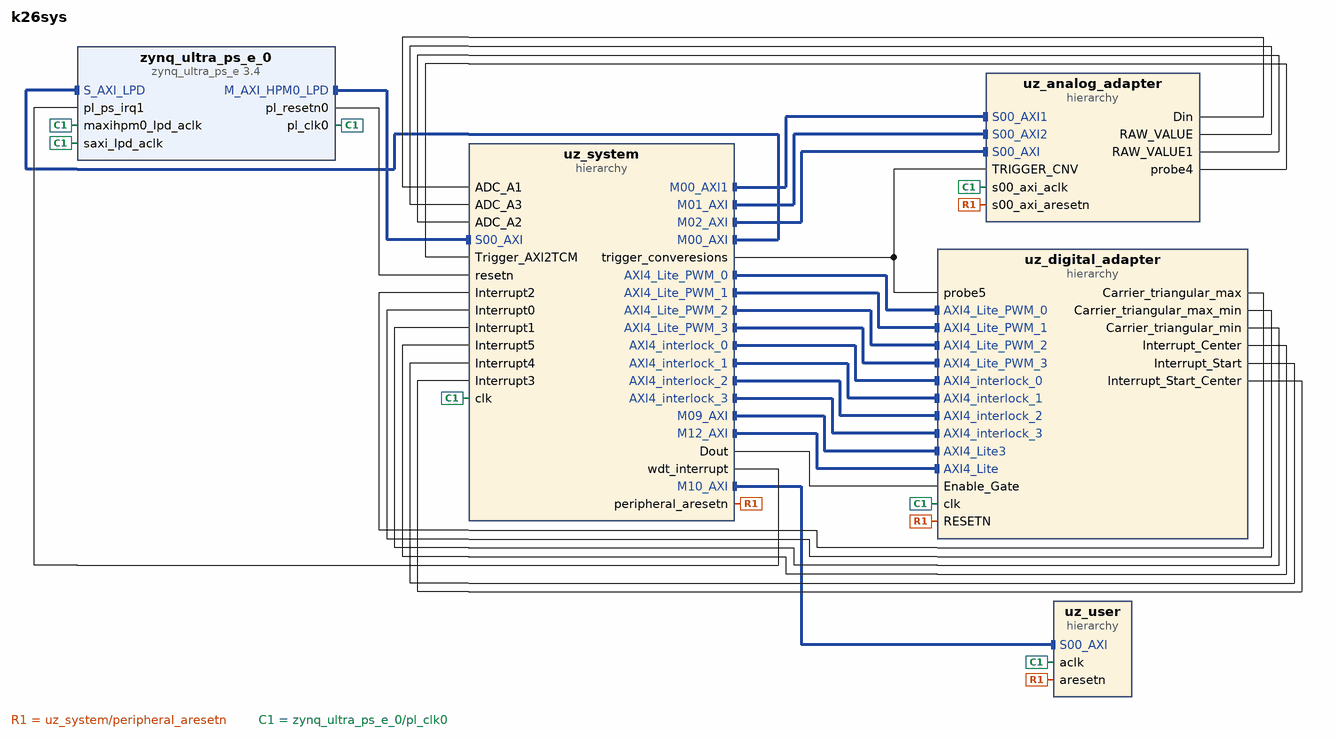
[diagram p0: block diagram of the top level]
# Vivado block design k26sys, xck26-sfvc784-2LV-c, Vivado 2022.2
create_bd_design k26sys

create_bd_cell -type ip -vlnv xilinx.com:ip:zynq_ultra_ps_e:3.4 zynq_ultra_ps_e_0
set_property -dict [list \
  CONFIG.PSU_BANK_0_IO_STANDARD LVCMOS18 \
  CONFIG.PSU_BANK_1_IO_STANDARD LVCMOS18 \
  CONFIG.PSU_BANK_2_IO_STANDARD LVCMOS18 \
  CONFIG.PSU_BANK_3_IO_STANDARD LVCMOS18 \
  CONFIG.PSU_USB3__DUAL_CLOCK_ENABLE 0 \
  CONFIG.PSU__CRF_APB__ACPU_CTRL__FREQMHZ 1333.333 \
  CONFIG.PSU__CRF_APB__ACPU_CTRL__SRCSEL APLL \
  CONFIG.PSU__CRF_APB__APLL_CTRL__SRCSEL PSS_REF_CLK \
  CONFIG.PSU__CRF_APB__APLL_FRAC_CFG__ENABLED 1 \
  CONFIG.PSU__CRF_APB__DBG_FPD_CTRL__FREQMHZ 250 \
  CONFIG.PSU__CRF_APB__DBG_FPD_CTRL__SRCSEL IOPLL \
  CONFIG.PSU__CRF_APB__DBG_TRACE_CTRL__FREQMHZ 250 \
  CONFIG.PSU__CRF_APB__DBG_TRACE_CTRL__SRCSEL IOPLL \
  CONFIG.PSU__CRF_APB__DBG_TSTMP_CTRL__FREQMHZ 250 \
  CONFIG.PSU__CRF_APB__DBG_TSTMP_CTRL__SRCSEL IOPLL \
  CONFIG.PSU__CRF_APB__DDR_CTRL__FREQMHZ 1200 \
  CONFIG.PSU__CRF_APB__DDR_CTRL__SRCSEL DPLL \
  CONFIG.PSU__CRF_APB__DPDMA_REF_CTRL__FREQMHZ 600 \
  CONFIG.PSU__CRF_APB__DPDMA_REF_CTRL__SRCSEL APLL \
  CONFIG.PSU__CRF_APB__DPLL_CTRL__SRCSEL PSS_REF_CLK \
  CONFIG.PSU__CRF_APB__DP_AUDIO_REF_CTRL__SRCSEL RPLL \
  CONFIG.PSU__CRF_APB__DP_STC_REF_CTRL__SRCSEL RPLL \
  CONFIG.PSU__CRF_APB__DP_VIDEO_REF_CTRL__SRCSEL VPLL \
  CONFIG.PSU__CRF_APB__GDMA_REF_CTRL__FREQMHZ 600 \
  CONFIG.PSU__CRF_APB__GDMA_REF_CTRL__SRCSEL DPLL \
  CONFIG.PSU__CRF_APB__GPU_REF_CTRL__FREQMHZ 600 \
  CONFIG.PSU__CRF_APB__GPU_REF_CTRL__SRCSEL IOPLL \
  CONFIG.PSU__CRF_APB__TOPSW_LSBUS_CTRL__FREQMHZ 100 \
  CONFIG.PSU__CRF_APB__TOPSW_LSBUS_CTRL__SRCSEL IOPLL \
  CONFIG.PSU__CRF_APB__TOPSW_MAIN_CTRL__FREQMHZ 533.33 \
  CONFIG.PSU__CRF_APB__TOPSW_MAIN_CTRL__SRCSEL DPLL \
  CONFIG.PSU__CRF_APB__VPLL_CTRL__SRCSEL PSS_REF_CLK \
  CONFIG.PSU__CRL_APB__ADMA_REF_CTRL__FREQMHZ 500 \
  CONFIG.PSU__CRL_APB__ADMA_REF_CTRL__SRCSEL IOPLL \
  CONFIG.PSU__CRL_APB__CPU_R5_CTRL__FREQMHZ 533.333 \
  CONFIG.PSU__CRL_APB__CPU_R5_CTRL__SRCSEL RPLL \
  CONFIG.PSU__CRL_APB__DBG_LPD_CTRL__FREQMHZ 250 \
  CONFIG.PSU__CRL_APB__DBG_LPD_CTRL__SRCSEL IOPLL \
  CONFIG.PSU__CRL_APB__IOPLL_CTRL__SRCSEL PSS_REF_CLK \
  CONFIG.PSU__CRL_APB__IOU_SWITCH_CTRL__FREQMHZ 250 \
  CONFIG.PSU__CRL_APB__IOU_SWITCH_CTRL__SRCSEL IOPLL \
  CONFIG.PSU__CRL_APB__LPD_LSBUS_CTRL__FREQMHZ 100 \
  CONFIG.PSU__CRL_APB__LPD_LSBUS_CTRL__SRCSEL IOPLL \
  CONFIG.PSU__CRL_APB__LPD_SWITCH_CTRL__FREQMHZ 500 \
  CONFIG.PSU__CRL_APB__LPD_SWITCH_CTRL__SRCSEL IOPLL \
  CONFIG.PSU__CRL_APB__PCAP_CTRL__FREQMHZ 200 \
  CONFIG.PSU__CRL_APB__PCAP_CTRL__SRCSEL IOPLL \
  CONFIG.PSU__CRL_APB__PL0_REF_CTRL__FREQMHZ 100 \
  CONFIG.PSU__CRL_APB__PL0_REF_CTRL__SRCSEL IOPLL \
  CONFIG.PSU__CRL_APB__QSPI_REF_CTRL__FREQMHZ 125 \
  CONFIG.PSU__CRL_APB__QSPI_REF_CTRL__SRCSEL IOPLL \
  CONFIG.PSU__CRL_APB__RPLL_CTRL__SRCSEL PSS_REF_CLK \
  CONFIG.PSU__CRL_APB__SPI1_REF_CTRL__SRCSEL IOPLL \
  CONFIG.PSU__CRL_APB__TIMESTAMP_REF_CTRL__FREQMHZ 100 \
  CONFIG.PSU__CRL_APB__TIMESTAMP_REF_CTRL__SRCSEL IOPLL \
  CONFIG.PSU__CRL_APB__USB3__ENABLE 0 \
  CONFIG.PSU__CSUPMU__PERIPHERAL__VALID 1 \
  CONFIG.PSU__DDRC__BUS_WIDTH {64 Bit} \
  CONFIG.PSU__DDRC__COMPONENTS Components \
  CONFIG.PSU__DDRC__DEVICE_CAPACITY {8192 MBits} \
  CONFIG.PSU__DDRC__DRAM_WIDTH {16 Bits} \
  CONFIG.PSU__DDRC__ECC Disabled \
  CONFIG.PSU__DDRC__MEMORY_TYPE {DDR 4} \
  CONFIG.PSU__DDRC__SPEED_BIN DDR4_2400R \
  CONFIG.PSU__DDR_HIGH_ADDRESS_GUI_ENABLE 1 \
  CONFIG.PSU__DDR__INTERFACE__FREQMHZ 600.000 \
  CONFIG.PSU__DISPLAYPORT__LANE0__ENABLE 1 \
  CONFIG.PSU__DISPLAYPORT__LANE0__IO {GT Lane1} \
  CONFIG.PSU__DISPLAYPORT__LANE1__ENABLE 0 \
  CONFIG.PSU__DISPLAYPORT__PERIPHERAL__ENABLE 1 \
  CONFIG.PSU__DPAUX__PERIPHERAL__ENABLE 1 \
  CONFIG.PSU__DPAUX__PERIPHERAL__IO {MIO 27 .. 30} \
  CONFIG.PSU__DP__LANE_SEL None \
  CONFIG.PSU__ENET1__GRP_MDIO__ENABLE 1 \
  CONFIG.PSU__ENET1__GRP_MDIO__IO {MIO 50 .. 51} \
  CONFIG.PSU__ENET1__PERIPHERAL__ENABLE 1 \
  CONFIG.PSU__ENET1__PERIPHERAL__IO {MIO 38 .. 49} \
  CONFIG.PSU__ENET3__PERIPHERAL__ENABLE 0 \
  CONFIG.PSU__FPGA_PL0_ENABLE 1 \
  CONFIG.PSU__GEM__TSU__ENABLE 0 \
  CONFIG.PSU__GPIO0_MIO__IO {MIO 0 .. 25} \
  CONFIG.PSU__GPIO0_MIO__PERIPHERAL__ENABLE 1 \
  CONFIG.PSU__GPIO1_MIO__IO {MIO 26 .. 51} \
  CONFIG.PSU__GPIO1_MIO__PERIPHERAL__ENABLE 1 \
  CONFIG.PSU__GT__LINK_SPEED HBR \
  CONFIG.PSU__GT__PRE_EMPH_LVL_4 0 \
  CONFIG.PSU__GT__VLT_SWNG_LVL_4 0 \
  CONFIG.PSU__I2C1__PERIPHERAL__ENABLE 1 \
  CONFIG.PSU__I2C1__PERIPHERAL__IO {MIO 24 .. 25} \
  CONFIG.PSU__IOU_SLCR__IOU_TTC_APB_CLK__TTC0_SEL APB \
  CONFIG.PSU__IOU_SLCR__IOU_TTC_APB_CLK__TTC1_SEL APB \
  CONFIG.PSU__IOU_SLCR__IOU_TTC_APB_CLK__TTC2_SEL APB \
  CONFIG.PSU__IOU_SLCR__IOU_TTC_APB_CLK__TTC3_SEL APB \
  CONFIG.PSU__MAXIGP2__DATA_WIDTH 128 \
  CONFIG.PSU__OVERRIDE__BASIC_CLOCK 0 \
  CONFIG.PSU__PMU_COHERENCY 0 \
  CONFIG.PSU__PMU__AIBACK__ENABLE 0 \
  CONFIG.PSU__PMU__EMIO_GPI__ENABLE 0 \
  CONFIG.PSU__PMU__EMIO_GPO__ENABLE 0 \
  CONFIG.PSU__PMU__GPI0__ENABLE 1 \
  CONFIG.PSU__PMU__GPI0__IO {MIO 26} \
  CONFIG.PSU__PMU__GPI1__ENABLE 0 \
  CONFIG.PSU__PMU__GPI2__ENABLE 0 \
  CONFIG.PSU__PMU__GPI3__ENABLE 0 \
  CONFIG.PSU__PMU__GPI4__ENABLE 0 \
  CONFIG.PSU__PMU__GPI5__ENABLE 1 \
  CONFIG.PSU__PMU__GPI5__IO {MIO 31} \
  CONFIG.PSU__PMU__GPO0__ENABLE 0 \
  CONFIG.PSU__PMU__GPO1__ENABLE 0 \
  CONFIG.PSU__PMU__GPO2__ENABLE 0 \
  CONFIG.PSU__PMU__GPO3__ENABLE 1 \
  CONFIG.PSU__PMU__GPO3__IO {MIO 35} \
  CONFIG.PSU__PMU__GPO3__POLARITY low \
  CONFIG.PSU__PMU__GPO4__ENABLE 0 \
  CONFIG.PSU__PMU__GPO5__ENABLE 0 \
  CONFIG.PSU__PMU__PERIPHERAL__ENABLE 1 \
  CONFIG.PSU__PMU__PLERROR__ENABLE 0 \
  CONFIG.PSU__PRESET_APPLIED 1 \
  CONFIG.PSU__PSS_REF_CLK__FREQMHZ 33.333 \
  CONFIG.PSU__QSPI_COHERENCY 0 \
  CONFIG.PSU__QSPI_ROUTE_THROUGH_FPD 0 \
  CONFIG.PSU__QSPI__GRP_FBCLK__ENABLE 0 \
  CONFIG.PSU__QSPI__PERIPHERAL__DATA_MODE x4 \
  CONFIG.PSU__QSPI__PERIPHERAL__ENABLE 1 \
  CONFIG.PSU__QSPI__PERIPHERAL__IO {MIO 0 .. 5} \
  CONFIG.PSU__QSPI__PERIPHERAL__MODE Single \
  CONFIG.PSU__SAXIGP6__DATA_WIDTH 32 \
  CONFIG.PSU__SPI1__GRP_SS0__IO {MIO 9} \
  CONFIG.PSU__SPI1__PERIPHERAL__ENABLE 1 \
  CONFIG.PSU__SPI1__PERIPHERAL__IO {MIO 6 .. 11} \
  CONFIG.PSU__SWDT0__CLOCK__ENABLE 0 \
  CONFIG.PSU__SWDT0__PERIPHERAL__ENABLE 1 \
  CONFIG.PSU__SWDT0__RESET__ENABLE 0 \
  CONFIG.PSU__SWDT1__CLOCK__ENABLE 0 \
  CONFIG.PSU__SWDT1__PERIPHERAL__ENABLE 1 \
  CONFIG.PSU__SWDT1__RESET__ENABLE 0 \
  CONFIG.PSU__TSU__BUFG_PORT_PAIR 0 \
  CONFIG.PSU__TTC0__CLOCK__ENABLE 0 \
  CONFIG.PSU__TTC0__PERIPHERAL__ENABLE 1 \
  CONFIG.PSU__TTC0__WAVEOUT__ENABLE 1 \
  CONFIG.PSU__TTC0__WAVEOUT__IO EMIO \
  CONFIG.PSU__TTC1__CLOCK__ENABLE 0 \
  CONFIG.PSU__TTC1__PERIPHERAL__ENABLE 1 \
  CONFIG.PSU__TTC1__WAVEOUT__ENABLE 0 \
  CONFIG.PSU__TTC2__CLOCK__ENABLE 0 \
  CONFIG.PSU__TTC2__PERIPHERAL__ENABLE 1 \
  CONFIG.PSU__TTC2__WAVEOUT__ENABLE 0 \
  CONFIG.PSU__TTC3__CLOCK__ENABLE 0 \
  CONFIG.PSU__TTC3__PERIPHERAL__ENABLE 1 \
  CONFIG.PSU__TTC3__WAVEOUT__ENABLE 0 \
  CONFIG.PSU__UART0__PERIPHERAL__ENABLE 0 \
  CONFIG.PSU__UART1__BAUD_RATE 115200 \
  CONFIG.PSU__UART1__MODEM__ENABLE 0 \
  CONFIG.PSU__UART1__PERIPHERAL__ENABLE 1 \
  CONFIG.PSU__UART1__PERIPHERAL__IO {MIO 36 .. 37} \
  CONFIG.PSU__USB0__PERIPHERAL__ENABLE 0 \
  CONFIG.PSU__USB0__RESET__ENABLE 1 \
  CONFIG.PSU__USB0__RESET__IO {MIO 76} \
  CONFIG.PSU__USB1__RESET__ENABLE 1 \
  CONFIG.PSU__USB1__RESET__IO {MIO 77} \
  CONFIG.PSU__USE__IRQ0 1 \
  CONFIG.PSU__USE__IRQ1 1 \
  CONFIG.PSU__USE__M_AXI_GP0 0 \
  CONFIG.PSU__USE__M_AXI_GP1 0 \
  CONFIG.PSU__USE__M_AXI_GP2 1 \
  CONFIG.PSU__USE__S_AXI_GP6 1 \
] [get_bd_cells zynq_ultra_ps_e_0]
# 306 more settings of zynq_ultra_ps_e_0 are not shown: defaults, MIO pin electricals, DDR timing, and values the tool derives
create_bd_cell -type hier uz_system
create_bd_cell -type hier uz_analog_adapter
create_bd_cell -type hier uz_digital_adapter
create_bd_cell -type hier uz_user

# ---- hierarchy /uz_system ----
current_bd_instance /uz_system
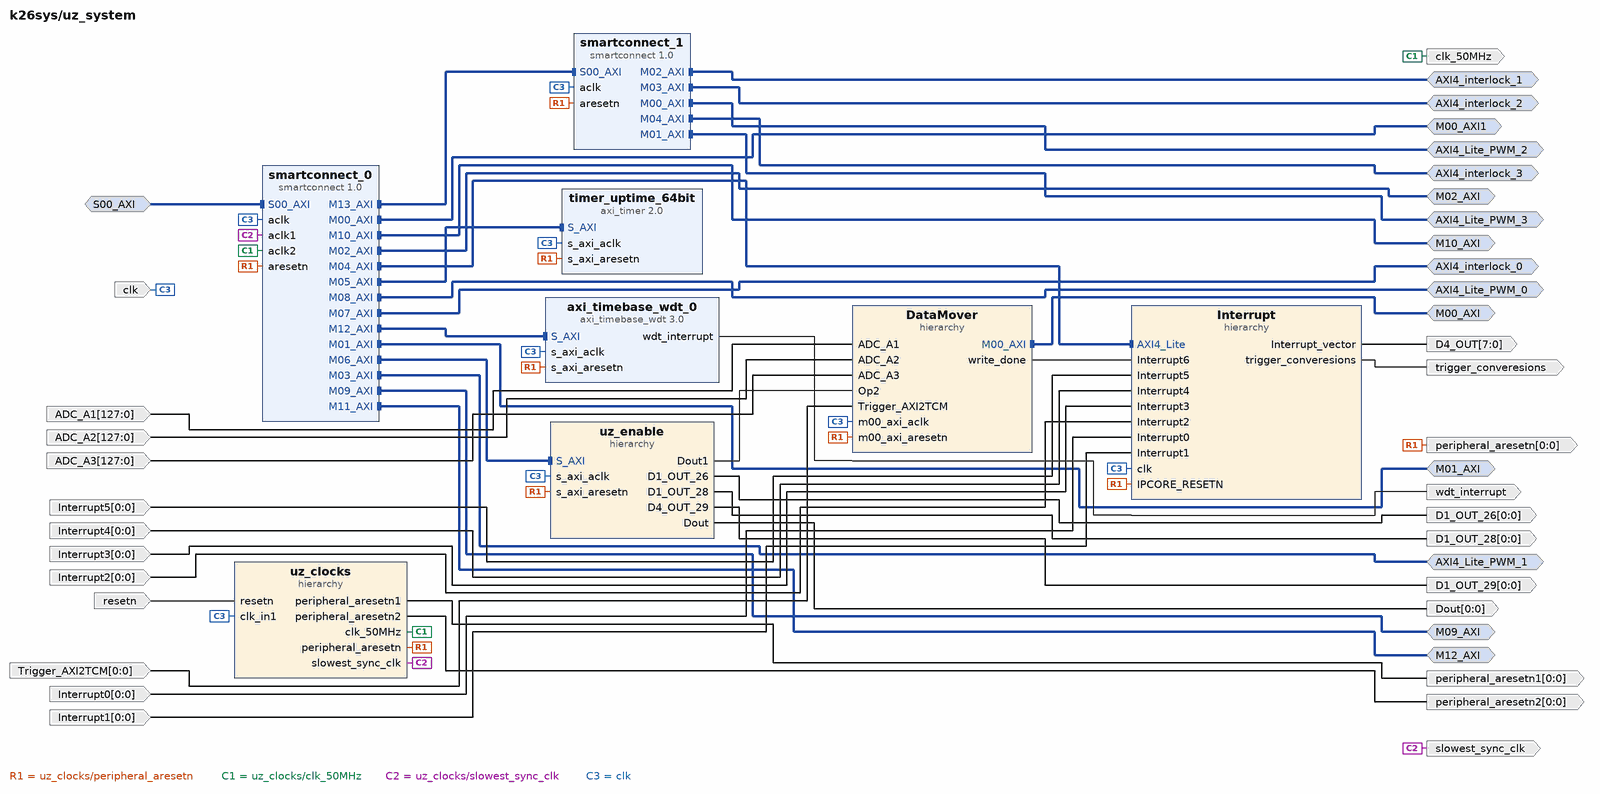
[diagram p1: block diagram inside /uz_system]
create_bd_intf_pin -mode Master -vlnv xilinx.com:interface:aximm_rtl:1.0 AXI4_Lite_PWM_0
create_bd_intf_pin -mode Master -vlnv xilinx.com:interface:aximm_rtl:1.0 AXI4_Lite_PWM_1
create_bd_intf_pin -mode Master -vlnv xilinx.com:interface:aximm_rtl:1.0 AXI4_Lite_PWM_2
create_bd_intf_pin -mode Master -vlnv xilinx.com:interface:aximm_rtl:1.0 AXI4_Lite_PWM_3
create_bd_intf_pin -mode Master -vlnv xilinx.com:interface:aximm_rtl:1.0 AXI4_interlock_0
create_bd_intf_pin -mode Master -vlnv xilinx.com:interface:aximm_rtl:1.0 AXI4_interlock_1
create_bd_intf_pin -mode Master -vlnv xilinx.com:interface:aximm_rtl:1.0 AXI4_interlock_2
create_bd_intf_pin -mode Master -vlnv xilinx.com:interface:aximm_rtl:1.0 AXI4_interlock_3
create_bd_intf_pin -mode Master -vlnv xilinx.com:interface:aximm_rtl:1.0 M00_AXI
create_bd_intf_pin -mode Master -vlnv xilinx.com:interface:aximm_rtl:1.0 M00_AXI1
create_bd_intf_pin -mode Master -vlnv xilinx.com:interface:aximm_rtl:1.0 M01_AXI
create_bd_intf_pin -mode Master -vlnv xilinx.com:interface:aximm_rtl:1.0 M02_AXI
create_bd_intf_pin -mode Master -vlnv xilinx.com:interface:aximm_rtl:1.0 M09_AXI
create_bd_intf_pin -mode Master -vlnv xilinx.com:interface:aximm_rtl:1.0 M10_AXI
create_bd_intf_pin -mode Master -vlnv xilinx.com:interface:aximm_rtl:1.0 M12_AXI
create_bd_intf_pin -mode Slave -vlnv xilinx.com:interface:aximm_rtl:1.0 S00_AXI
create_bd_pin -dir I -from 127 -to 0 ADC_A1
create_bd_pin -dir I -from 127 -to 0 ADC_A2
create_bd_pin -dir I -from 127 -to 0 ADC_A3
create_bd_pin -dir O -from 0 -to 0 D1_OUT_26
create_bd_pin -dir O -from 0 -to 0 D1_OUT_28
create_bd_pin -dir O -from 0 -to 0 D1_OUT_29
create_bd_pin -dir O -from 7 -to 0 D4_OUT
create_bd_pin -dir O -from 0 -to 0 Dout
create_bd_pin -dir I -from 0 -to 0 Interrupt0
create_bd_pin -dir I -from 0 -to 0 Interrupt1
create_bd_pin -dir I -from 0 -to 0 Interrupt2
create_bd_pin -dir I -from 0 -to 0 Interrupt3
create_bd_pin -dir I -from 0 -to 0 Interrupt4
create_bd_pin -dir I -from 0 -to 0 Interrupt5
create_bd_pin -dir I -from 0 -to 0 Trigger_AXI2TCM
create_bd_pin -dir I -type clk clk
create_bd_pin -dir O -type clk clk_50MHz
create_bd_pin -dir O -from 0 -to 0 -type rst peripheral_aresetn
create_bd_pin -dir O -from 0 -to 0 -type rst peripheral_aresetn1
create_bd_pin -dir O -from 0 -to 0 -type rst peripheral_aresetn2
create_bd_pin -dir I -type rst resetn
create_bd_pin -dir O -type clk slowest_sync_clk
create_bd_pin -dir O trigger_converesions
create_bd_pin -dir O -type intr wdt_interrupt

create_bd_cell -type hier DataMover
create_bd_cell -type hier Interrupt
create_bd_cell -type ip -vlnv xilinx.com:ip:axi_timebase_wdt:3.0 axi_timebase_wdt_0
set_property -dict {CONFIG.ENABLE_WINDOW_WDT 1 CONFIG.SST_COUNT_WIDTH 30} [get_bd_cells axi_timebase_wdt_0]
create_bd_cell -type ip -vlnv xilinx.com:ip:smartconnect:1.0 smartconnect_0
set_property -dict {CONFIG.NUM_CLKS 3 CONFIG.NUM_MI 14 CONFIG.NUM_SI 1} [get_bd_cells smartconnect_0]
create_bd_cell -type ip -vlnv xilinx.com:ip:smartconnect:1.0 smartconnect_1
set_property -dict {CONFIG.NUM_MI 5 CONFIG.NUM_SI 1} [get_bd_cells smartconnect_1]
create_bd_cell -type ip -vlnv xilinx.com:ip:axi_timer:2.0 timer_uptime_64bit
set_property -dict {CONFIG.mode_64bit 1} [get_bd_cells timer_uptime_64bit]
create_bd_cell -type hier uz_clocks
create_bd_cell -type hier uz_enable

# ---- hierarchy /uz_system/DataMover ----
current_bd_instance /uz_system/DataMover
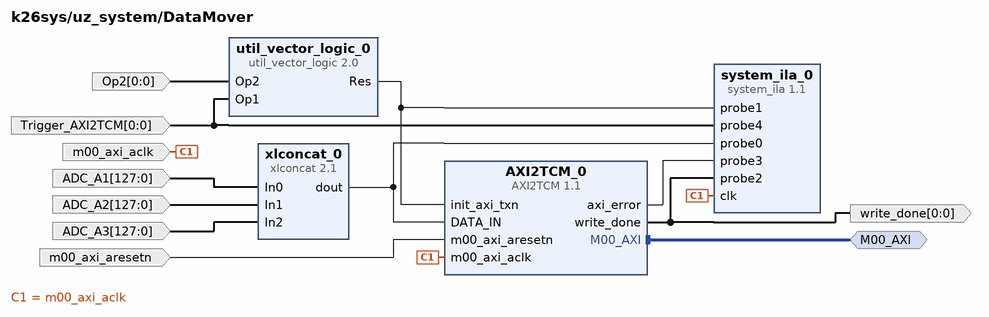
[diagram p2: block diagram inside /uz_system/DataMover]
create_bd_intf_pin -mode Master -vlnv xilinx.com:interface:aximm_rtl:1.0 M00_AXI
create_bd_pin -dir I -from 127 -to 0 ADC_A1
create_bd_pin -dir I -from 127 -to 0 ADC_A2
create_bd_pin -dir I -from 127 -to 0 ADC_A3
create_bd_pin -dir I -from 0 -to 0 Op2
create_bd_pin -dir I -from 0 -to 0 Trigger_AXI2TCM
create_bd_pin -dir I -type clk m00_axi_aclk
create_bd_pin -dir I -type rst m00_axi_aresetn
create_bd_pin -dir O -from 0 -to 0 write_done

create_bd_cell -type ip -vlnv TUM:user:AXI2TCM:1.1 AXI2TCM_0
set_property -dict {CONFIG.C_M00_NUMBER_of_ADCs 24} [get_bd_cells AXI2TCM_0]
create_bd_cell -type ip -vlnv xilinx.com:ip:system_ila:1.1 system_ila_0
set_property -dict {CONFIG.C_DATA_DEPTH 1024 CONFIG.C_MON_TYPE NATIVE CONFIG.C_NUM_OF_PROBES 5} [get_bd_cells system_ila_0]
create_bd_cell -type ip -vlnv xilinx.com:ip:util_vector_logic:2.0 util_vector_logic_0
set_property -dict {CONFIG.C_SIZE 1} [get_bd_cells util_vector_logic_0]
create_bd_cell -type ip -vlnv xilinx.com:ip:xlconcat:2.1 xlconcat_0
set_property -dict {CONFIG.NUM_PORTS 3} [get_bd_cells xlconcat_0]

# ---- hierarchy /uz_system/Interrupt ----
current_bd_instance /uz_system/Interrupt
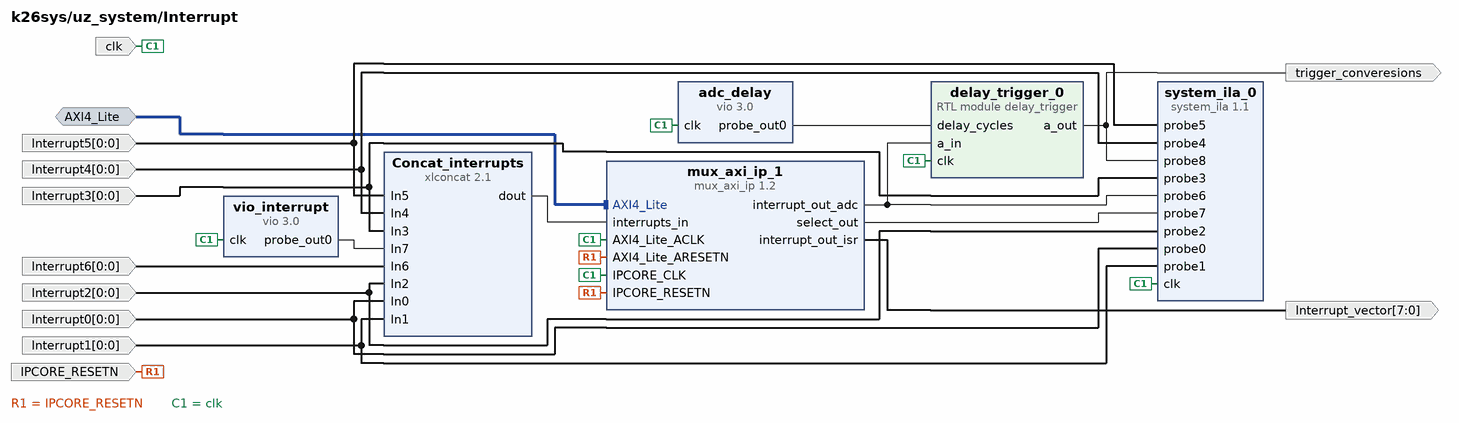
[diagram p3: block diagram inside /uz_system/Interrupt]
create_bd_intf_pin -mode Slave -vlnv xilinx.com:interface:aximm_rtl:1.0 AXI4_Lite
create_bd_pin -dir I -type rst IPCORE_RESETN
create_bd_pin -dir I -from 0 -to 0 Interrupt0
create_bd_pin -dir I -from 0 -to 0 Interrupt1
create_bd_pin -dir I -from 0 -to 0 Interrupt2
create_bd_pin -dir I -from 0 -to 0 Interrupt3
create_bd_pin -dir I -from 0 -to 0 Interrupt4
create_bd_pin -dir I -from 0 -to 0 Interrupt5
create_bd_pin -dir I -from 0 -to 0 Interrupt6
create_bd_pin -dir O -from 7 -to 0 Interrupt_vector
create_bd_pin -dir I -type clk clk
create_bd_pin -dir O trigger_converesions

create_bd_cell -type ip -vlnv xilinx.com:ip:xlconcat:2.1 Concat_interrupts
set_property -dict {CONFIG.NUM_PORTS 8} [get_bd_cells Concat_interrupts]
create_bd_cell -type ip -vlnv xilinx.com:ip:vio:3.0 adc_delay
set_property -dict {CONFIG.C_NUM_PROBE_IN 0 CONFIG.C_PROBE_OUT0_WIDTH 11} [get_bd_cells adc_delay]
create_bd_cell -type module -reference delay_trigger delay_trigger_0
create_bd_cell -type ip -vlnv xilinx.com:ip:mux_axi_ip:1.2 mux_axi_ip_1
create_bd_cell -type ip -vlnv xilinx.com:ip:system_ila:1.1 system_ila_0
set_property -dict {CONFIG.C_DATA_DEPTH 16384 CONFIG.C_MON_TYPE NATIVE CONFIG.C_NUM_OF_PROBES 9} [get_bd_cells system_ila_0]
create_bd_cell -type ip -vlnv xilinx.com:ip:vio:3.0 vio_interrupt
set_property -dict {CONFIG.C_NUM_PROBE_IN 0} [get_bd_cells vio_interrupt]

# ---- hierarchy /uz_system/uz_clocks ----
current_bd_instance /uz_system/uz_clocks
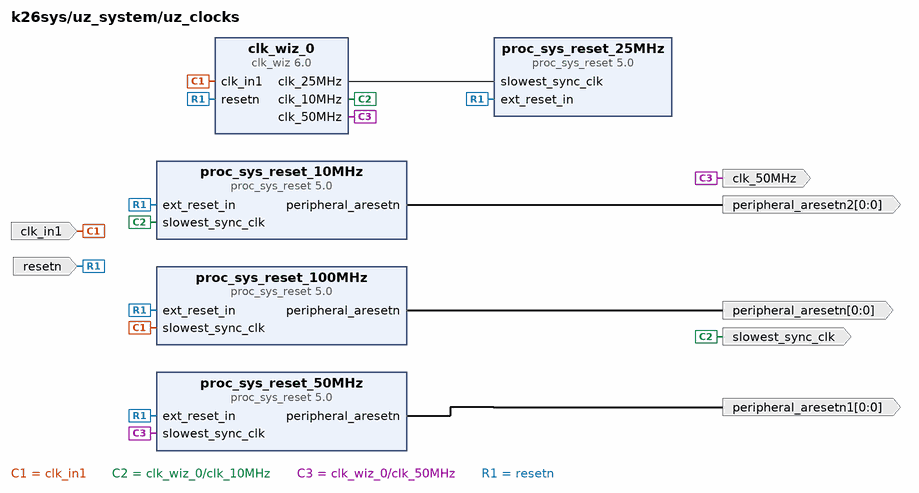
[diagram p4: block diagram inside /uz_system/uz_clocks]
create_bd_pin -dir O -type clk clk_50MHz
create_bd_pin -dir I -type clk clk_in1
create_bd_pin -dir O -from 0 -to 0 -type rst peripheral_aresetn
create_bd_pin -dir O -from 0 -to 0 -type rst peripheral_aresetn1
create_bd_pin -dir O -from 0 -to 0 -type rst peripheral_aresetn2
create_bd_pin -dir I -type rst resetn
create_bd_pin -dir O -type clk slowest_sync_clk

create_bd_cell -type ip -vlnv xilinx.com:ip:clk_wiz:6.0 clk_wiz_0
set_property -dict [list \
  CONFIG.AUTO_PRIMITIVE PLL \
  CONFIG.CLKOUT1_DRIVES Buffer \
  CONFIG.CLKOUT1_JITTER 167.018 \
  CONFIG.CLKOUT1_PHASE_ERROR 114.213 \
  CONFIG.CLKOUT1_REQUESTED_OUT_FREQ 50.000 \
  CONFIG.CLKOUT2_DRIVES Buffer \
  CONFIG.CLKOUT2_JITTER 229.364 \
  CONFIG.CLKOUT2_PHASE_ERROR 114.213 \
  CONFIG.CLKOUT2_REQUESTED_OUT_FREQ 10.000 \
  CONFIG.CLKOUT2_USED true \
  CONFIG.CLKOUT3_DRIVES Buffer \
  CONFIG.CLKOUT3_JITTER 191.697 \
  CONFIG.CLKOUT3_PHASE_ERROR 114.213 \
  CONFIG.CLKOUT3_REQUESTED_OUT_FREQ 25.000 \
  CONFIG.CLKOUT3_USED true \
  CONFIG.CLKOUT4_DRIVES Buffer \
  CONFIG.CLKOUT5_DRIVES Buffer \
  CONFIG.CLKOUT6_DRIVES Buffer \
  CONFIG.CLKOUT7_DRIVES Buffer \
  CONFIG.CLK_OUT1_PORT clk_50MHz \
  CONFIG.CLK_OUT2_PORT clk_10MHz \
  CONFIG.CLK_OUT3_PORT clk_25MHz \
  CONFIG.FEEDBACK_SOURCE FDBK_AUTO \
  CONFIG.MMCM_CLKFBOUT_MULT_F 8 \
  CONFIG.MMCM_CLKIN1_PERIOD 10.000 \
  CONFIG.MMCM_CLKIN2_PERIOD 10.000 \
  CONFIG.MMCM_CLKOUT0_DIVIDE_F 16 \
  CONFIG.MMCM_CLKOUT1_DIVIDE 80 \
  CONFIG.MMCM_CLKOUT2_DIVIDE 32 \
  CONFIG.MMCM_COMPENSATION AUTO \
  CONFIG.MMCM_DIVCLK_DIVIDE 1 \
  CONFIG.NUM_OUT_CLKS 3 \
  CONFIG.OVERRIDE_MMCM false \
  CONFIG.PRIMITIVE Auto \
  CONFIG.PRIM_SOURCE Single_ended_clock_capable_pin \
  CONFIG.RESET_PORT resetn \
  CONFIG.RESET_TYPE ACTIVE_LOW \
  CONFIG.SECONDARY_SOURCE Single_ended_clock_capable_pin \
  CONFIG.USE_LOCKED false \
  CONFIG.USE_PHASE_ALIGNMENT false \
  CONFIG.USE_RESET true \
] [get_bd_cells clk_wiz_0]
create_bd_cell -type ip -vlnv xilinx.com:ip:proc_sys_reset:5.0 proc_sys_reset_100MHz
create_bd_cell -type ip -vlnv xilinx.com:ip:proc_sys_reset:5.0 proc_sys_reset_10MHz
create_bd_cell -type ip -vlnv xilinx.com:ip:proc_sys_reset:5.0 proc_sys_reset_25MHz
create_bd_cell -type ip -vlnv xilinx.com:ip:proc_sys_reset:5.0 proc_sys_reset_50MHz

# ---- hierarchy /uz_system/uz_enable ----
current_bd_instance /uz_system/uz_enable
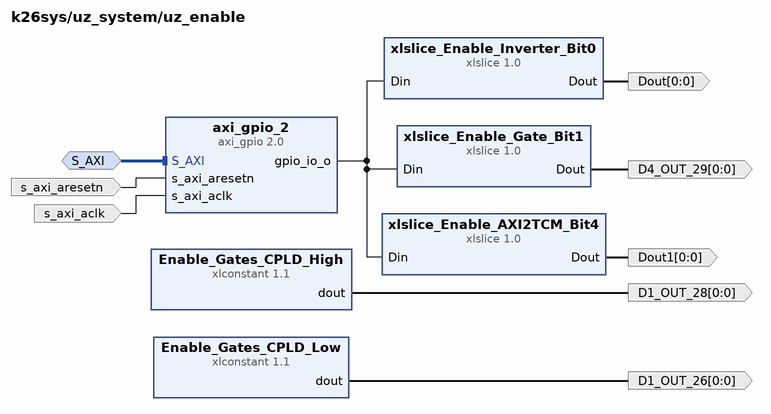
[diagram p5: block diagram inside /uz_system/uz_enable]
create_bd_intf_pin -mode Slave -vlnv xilinx.com:interface:aximm_rtl:1.0 S_AXI
create_bd_pin -dir O -from 0 -to 0 D1_OUT_26
create_bd_pin -dir O -from 0 -to 0 D1_OUT_28
create_bd_pin -dir O -from 0 -to 0 D4_OUT_29
create_bd_pin -dir O -from 0 -to 0 Dout
create_bd_pin -dir O -from 0 -to 0 Dout1
create_bd_pin -dir I -type clk s_axi_aclk
create_bd_pin -dir I -type rst s_axi_aresetn

create_bd_cell -type ip -vlnv xilinx.com:ip:xlconstant:1.1 Enable_Gates_CPLD_High
create_bd_cell -type ip -vlnv xilinx.com:ip:xlconstant:1.1 Enable_Gates_CPLD_Low
set_property -dict {CONFIG.CONST_VAL 0} [get_bd_cells Enable_Gates_CPLD_Low]
create_bd_cell -type ip -vlnv xilinx.com:ip:axi_gpio:2.0 axi_gpio_2
set_property -dict {CONFIG.C_GPIO_WIDTH 8} [get_bd_cells axi_gpio_2]
create_bd_cell -type ip -vlnv xilinx.com:ip:xlslice:1.0 xlslice_Enable_AXI2TCM_Bit4
set_property -dict [list \
  CONFIG.DIN_FROM 4 \
  CONFIG.DIN_TO 4 \
  CONFIG.DIN_WIDTH 8 \
  CONFIG.DOUT_WIDTH 1 \
] [get_bd_cells xlslice_Enable_AXI2TCM_Bit4]
create_bd_cell -type ip -vlnv xilinx.com:ip:xlslice:1.0 xlslice_Enable_Gate_Bit1
set_property -dict [list \
  CONFIG.DIN_FROM 1 \
  CONFIG.DIN_TO 1 \
  CONFIG.DIN_WIDTH 8 \
  CONFIG.DOUT_WIDTH 1 \
] [get_bd_cells xlslice_Enable_Gate_Bit1]
create_bd_cell -type ip -vlnv xilinx.com:ip:xlslice:1.0 xlslice_Enable_Inverter_Bit0
set_property -dict {CONFIG.DIN_FROM 0 CONFIG.DIN_TO 0 CONFIG.DIN_WIDTH 8} [get_bd_cells xlslice_Enable_Inverter_Bit0]

# ---- hierarchy /uz_analog_adapter ----
current_bd_instance /uz_analog_adapter
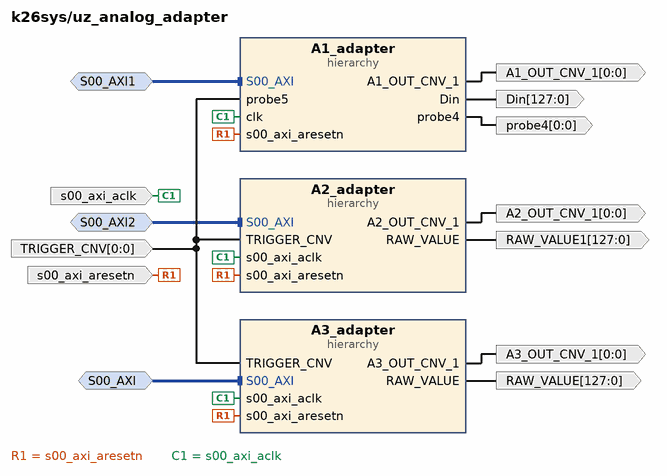
[diagram p6: block diagram inside /uz_analog_adapter]
create_bd_intf_pin -mode Slave -vlnv xilinx.com:interface:aximm_rtl:1.0 S00_AXI
create_bd_intf_pin -mode Slave -vlnv xilinx.com:interface:aximm_rtl:1.0 S00_AXI1
create_bd_intf_pin -mode Slave -vlnv xilinx.com:interface:aximm_rtl:1.0 S00_AXI2
create_bd_pin -dir O -from 0 -to 0 A1_OUT_CNV_1
create_bd_pin -dir O -from 0 -to 0 A2_OUT_CNV_1
create_bd_pin -dir O -from 0 -to 0 A3_OUT_CNV_1
create_bd_pin -dir O -from 127 -to 0 Din
create_bd_pin -dir O -from 127 -to 0 RAW_VALUE
create_bd_pin -dir O -from 127 -to 0 RAW_VALUE1
create_bd_pin -dir I -from 0 -to 0 TRIGGER_CNV
create_bd_pin -dir O -from 0 -to 0 probe4
create_bd_pin -dir I -type clk s00_axi_aclk
create_bd_pin -dir I -type rst s00_axi_aresetn

create_bd_cell -type hier A1_adapter
create_bd_cell -type hier A2_adapter
create_bd_cell -type hier A3_adapter

# ---- hierarchy /uz_analog_adapter/A1_adapter ----
current_bd_instance /uz_analog_adapter/A1_adapter
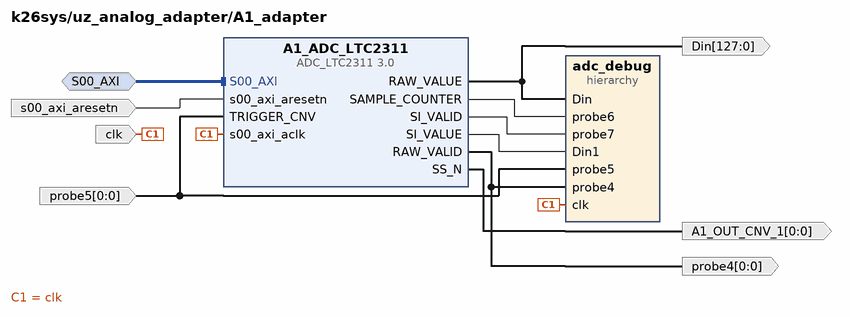
[diagram p7: block diagram inside /uz_analog_adapter/A1_adapter]
create_bd_intf_pin -mode Slave -vlnv xilinx.com:interface:aximm_rtl:1.0 S00_AXI
create_bd_pin -dir O -from 0 -to 0 A1_OUT_CNV_1
create_bd_pin -dir O -from 127 -to 0 Din
create_bd_pin -dir I -type clk clk
create_bd_pin -dir O -from 0 -to 0 probe4
create_bd_pin -dir I -from 0 -to 0 probe5
create_bd_pin -dir I -type rst s00_axi_aresetn

create_bd_cell -type ip -vlnv UltraZohm:user:ADC_LTC2311:3.0 A1_ADC_LTC2311
set_property -dict [list \
  CONFIG.DIFFERENTIAL false \
  CONFIG.RES_LSB 0 \
  CONFIG.RES_MSB 34 \
  CONFIG.SPI_MASTER 1 \
] [get_bd_cells A1_ADC_LTC2311]
create_bd_cell -type hier adc_debug

# ---- hierarchy /uz_analog_adapter/A1_adapter/adc_debug ----
current_bd_instance /uz_analog_adapter/A1_adapter/adc_debug
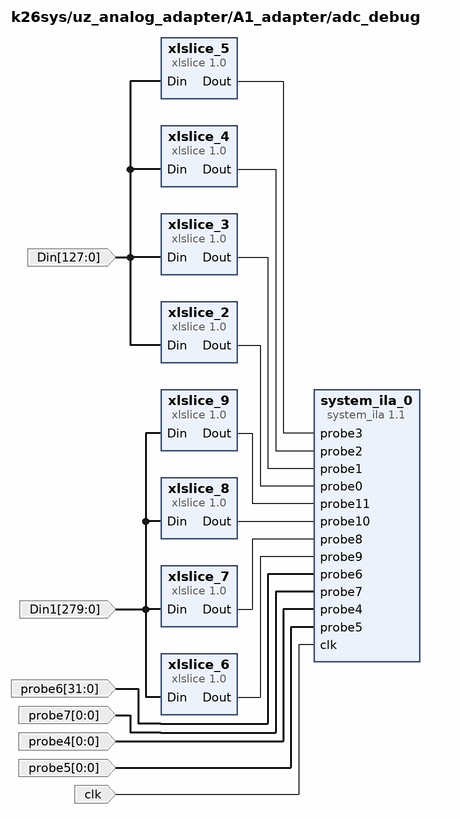
[diagram p8: block diagram inside /uz_analog_adapter/A1_adapter/adc_debug]
create_bd_pin -dir I -from 127 -to 0 Din
create_bd_pin -dir I -from 279 -to 0 Din1
create_bd_pin -dir I -type clk clk
create_bd_pin -dir I -from 0 -to 0 probe4
create_bd_pin -dir I -from 0 -to 0 probe5
create_bd_pin -dir I -from 31 -to 0 probe6
create_bd_pin -dir I -from 0 -to 0 probe7

create_bd_cell -type ip -vlnv xilinx.com:ip:system_ila:1.1 system_ila_0
set_property -dict {CONFIG.C_DATA_DEPTH 1024 CONFIG.C_MON_TYPE NATIVE CONFIG.C_NUM_OF_PROBES 12} [get_bd_cells system_ila_0]
create_bd_cell -type ip -vlnv xilinx.com:ip:xlslice:1.0 xlslice_2
set_property -dict {CONFIG.DIN_FROM 15 CONFIG.DIN_WIDTH 128 CONFIG.DOUT_WIDTH 16} [get_bd_cells xlslice_2]
create_bd_cell -type ip -vlnv xilinx.com:ip:xlslice:1.0 xlslice_3
set_property -dict {CONFIG.DIN_FROM 31 CONFIG.DIN_TO 16 CONFIG.DIN_WIDTH 128 CONFIG.DOUT_WIDTH 16} [get_bd_cells xlslice_3]
create_bd_cell -type ip -vlnv xilinx.com:ip:xlslice:1.0 xlslice_4
set_property -dict {CONFIG.DIN_FROM 47 CONFIG.DIN_TO 32 CONFIG.DIN_WIDTH 128 CONFIG.DOUT_WIDTH 16} [get_bd_cells xlslice_4]
create_bd_cell -type ip -vlnv xilinx.com:ip:xlslice:1.0 xlslice_5
set_property -dict {CONFIG.DIN_FROM 63 CONFIG.DIN_TO 48 CONFIG.DIN_WIDTH 128 CONFIG.DOUT_WIDTH 16} [get_bd_cells xlslice_5]
create_bd_cell -type ip -vlnv xilinx.com:ip:xlslice:1.0 xlslice_6
set_property -dict {CONFIG.DIN_FROM 69 CONFIG.DIN_TO 35 CONFIG.DIN_WIDTH 280 CONFIG.DOUT_WIDTH 35} [get_bd_cells xlslice_6]
create_bd_cell -type ip -vlnv xilinx.com:ip:xlslice:1.0 xlslice_7
set_property -dict {CONFIG.DIN_FROM 34 CONFIG.DIN_WIDTH 280 CONFIG.DOUT_WIDTH 35} [get_bd_cells xlslice_7]
create_bd_cell -type ip -vlnv xilinx.com:ip:xlslice:1.0 xlslice_8
set_property -dict {CONFIG.DIN_FROM 69 CONFIG.DIN_TO 35 CONFIG.DIN_WIDTH 280 CONFIG.DOUT_WIDTH 35} [get_bd_cells xlslice_8]
create_bd_cell -type ip -vlnv xilinx.com:ip:xlslice:1.0 xlslice_9
set_property -dict {CONFIG.DIN_FROM 104 CONFIG.DIN_TO 70 CONFIG.DIN_WIDTH 280 CONFIG.DOUT_WIDTH 35} [get_bd_cells xlslice_9]

# ---- hierarchy /uz_analog_adapter/A2_adapter ----
current_bd_instance /uz_analog_adapter/A2_adapter
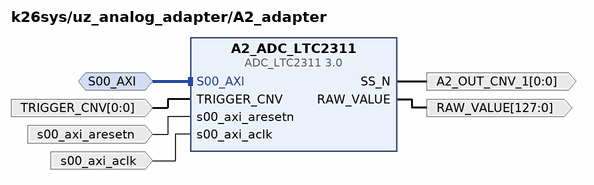
[diagram p9: block diagram inside /uz_analog_adapter/A2_adapter]
create_bd_intf_pin -mode Slave -vlnv xilinx.com:interface:aximm_rtl:1.0 S00_AXI
create_bd_pin -dir O -from 0 -to 0 A2_OUT_CNV_1
create_bd_pin -dir O -from 127 -to 0 RAW_VALUE
create_bd_pin -dir I -from 0 -to 0 TRIGGER_CNV
create_bd_pin -dir I -type clk s00_axi_aclk
create_bd_pin -dir I -type rst s00_axi_aresetn

create_bd_cell -type ip -vlnv UltraZohm:user:ADC_LTC2311:3.0 A2_ADC_LTC2311
set_property -dict {CONFIG.DIFFERENTIAL false CONFIG.RES_LSB 0 CONFIG.RES_MSB 34} [get_bd_cells A2_ADC_LTC2311]

# ---- hierarchy /uz_analog_adapter/A3_adapter ----
current_bd_instance /uz_analog_adapter/A3_adapter
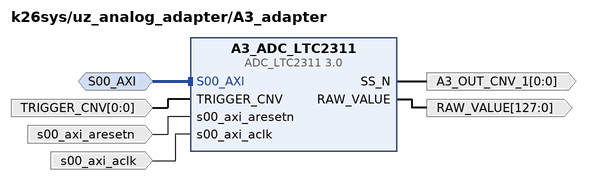
[diagram p10: block diagram inside /uz_analog_adapter/A3_adapter]
create_bd_intf_pin -mode Slave -vlnv xilinx.com:interface:aximm_rtl:1.0 S00_AXI
create_bd_pin -dir O -from 0 -to 0 A3_OUT_CNV_1
create_bd_pin -dir O -from 127 -to 0 RAW_VALUE
create_bd_pin -dir I -from 0 -to 0 TRIGGER_CNV
create_bd_pin -dir I -type clk s00_axi_aclk
create_bd_pin -dir I -type rst s00_axi_aresetn

create_bd_cell -type ip -vlnv UltraZohm:user:ADC_LTC2311:3.0 A3_ADC_LTC2311
set_property -dict {CONFIG.DIFFERENTIAL false CONFIG.RES_LSB 0 CONFIG.RES_MSB 34} [get_bd_cells A3_ADC_LTC2311]

# ---- hierarchy /uz_digital_adapter ----
current_bd_instance /uz_digital_adapter
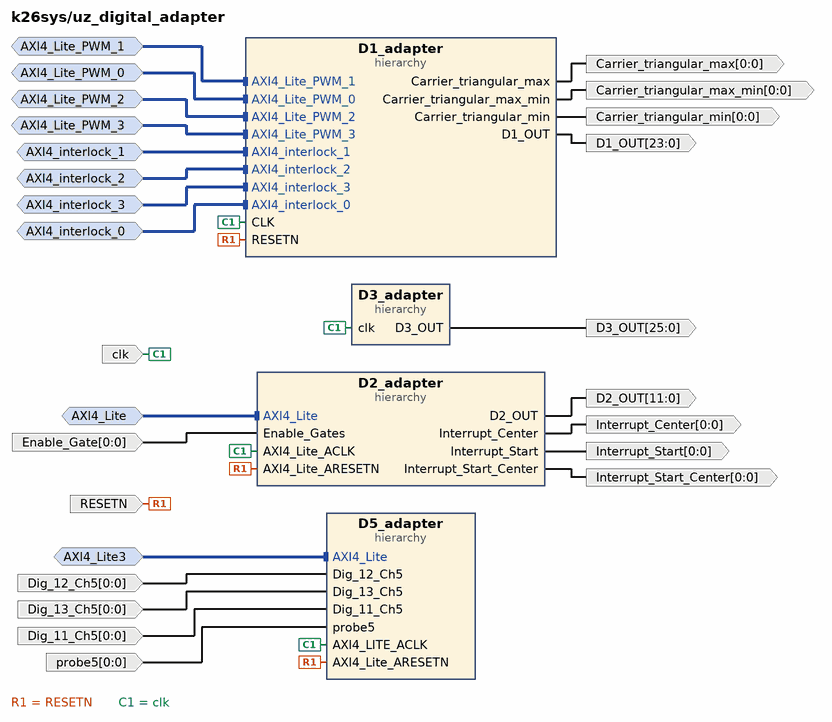
[diagram p11: block diagram inside /uz_digital_adapter]
create_bd_intf_pin -mode Slave -vlnv xilinx.com:interface:aximm_rtl:1.0 AXI4_Lite
create_bd_intf_pin -mode Slave -vlnv xilinx.com:interface:aximm_rtl:1.0 AXI4_Lite3
create_bd_intf_pin -mode Slave -vlnv xilinx.com:interface:aximm_rtl:1.0 AXI4_Lite_PWM_0
create_bd_intf_pin -mode Slave -vlnv xilinx.com:interface:aximm_rtl:1.0 AXI4_Lite_PWM_1
create_bd_intf_pin -mode Slave -vlnv xilinx.com:interface:aximm_rtl:1.0 AXI4_Lite_PWM_2
create_bd_intf_pin -mode Slave -vlnv xilinx.com:interface:aximm_rtl:1.0 AXI4_Lite_PWM_3
create_bd_intf_pin -mode Slave -vlnv xilinx.com:interface:aximm_rtl:1.0 AXI4_interlock_0
create_bd_intf_pin -mode Slave -vlnv xilinx.com:interface:aximm_rtl:1.0 AXI4_interlock_1
create_bd_intf_pin -mode Slave -vlnv xilinx.com:interface:aximm_rtl:1.0 AXI4_interlock_2
create_bd_intf_pin -mode Slave -vlnv xilinx.com:interface:aximm_rtl:1.0 AXI4_interlock_3
create_bd_pin -dir O -from 0 -to 0 Carrier_triangular_max
create_bd_pin -dir O -from 0 -to 0 Carrier_triangular_max_min
create_bd_pin -dir O -from 0 -to 0 Carrier_triangular_min
create_bd_pin -dir O -from 23 -to 0 D1_OUT
create_bd_pin -dir O -from 11 -to 0 D2_OUT
create_bd_pin -dir O -from 25 -to 0 D3_OUT
create_bd_pin -dir I -from 0 -to 0 Dig_11_Ch5
create_bd_pin -dir I -from 0 -to 0 Dig_12_Ch5
create_bd_pin -dir I -from 0 -to 0 Dig_13_Ch5
create_bd_pin -dir I -from 0 -to 0 Enable_Gate
create_bd_pin -dir O -from 0 -to 0 Interrupt_Center
create_bd_pin -dir O -from 0 -to 0 Interrupt_Start
create_bd_pin -dir O -from 0 -to 0 Interrupt_Start_Center
create_bd_pin -dir I -type rst RESETN
create_bd_pin -dir I -type clk clk
create_bd_pin -dir I -from 0 -to 0 probe5

create_bd_cell -type hier D1_adapter
create_bd_cell -type hier D2_adapter
create_bd_cell -type hier D3_adapter
create_bd_cell -type hier D5_adapter

# ---- hierarchy /uz_digital_adapter/D1_adapter ----
current_bd_instance /uz_digital_adapter/D1_adapter
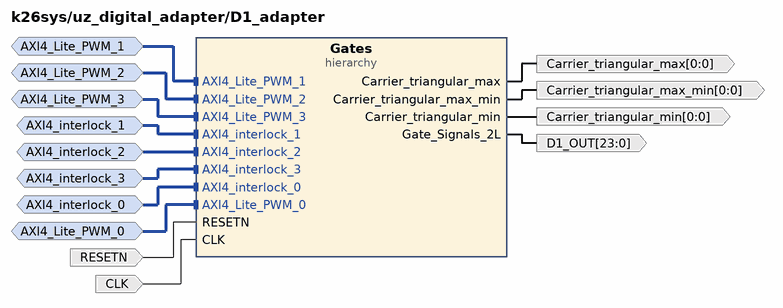
[diagram p12: block diagram inside /uz_digital_adapter/D1_adapter]
create_bd_intf_pin -mode Slave -vlnv xilinx.com:interface:aximm_rtl:1.0 AXI4_Lite_PWM_0
create_bd_intf_pin -mode Slave -vlnv xilinx.com:interface:aximm_rtl:1.0 AXI4_Lite_PWM_1
create_bd_intf_pin -mode Slave -vlnv xilinx.com:interface:aximm_rtl:1.0 AXI4_Lite_PWM_2
create_bd_intf_pin -mode Slave -vlnv xilinx.com:interface:aximm_rtl:1.0 AXI4_Lite_PWM_3
create_bd_intf_pin -mode Slave -vlnv xilinx.com:interface:aximm_rtl:1.0 AXI4_interlock_0
create_bd_intf_pin -mode Slave -vlnv xilinx.com:interface:aximm_rtl:1.0 AXI4_interlock_1
create_bd_intf_pin -mode Slave -vlnv xilinx.com:interface:aximm_rtl:1.0 AXI4_interlock_2
create_bd_intf_pin -mode Slave -vlnv xilinx.com:interface:aximm_rtl:1.0 AXI4_interlock_3
create_bd_pin -dir I -type clk CLK
create_bd_pin -dir O -from 0 -to 0 Carrier_triangular_max
create_bd_pin -dir O -from 0 -to 0 Carrier_triangular_max_min
create_bd_pin -dir O -from 0 -to 0 Carrier_triangular_min
create_bd_pin -dir O -from 23 -to 0 D1_OUT
create_bd_pin -dir I -type rst RESETN

create_bd_cell -type hier Gates

# ---- hierarchy /uz_digital_adapter/D1_adapter/Gates ----
current_bd_instance /uz_digital_adapter/D1_adapter/Gates
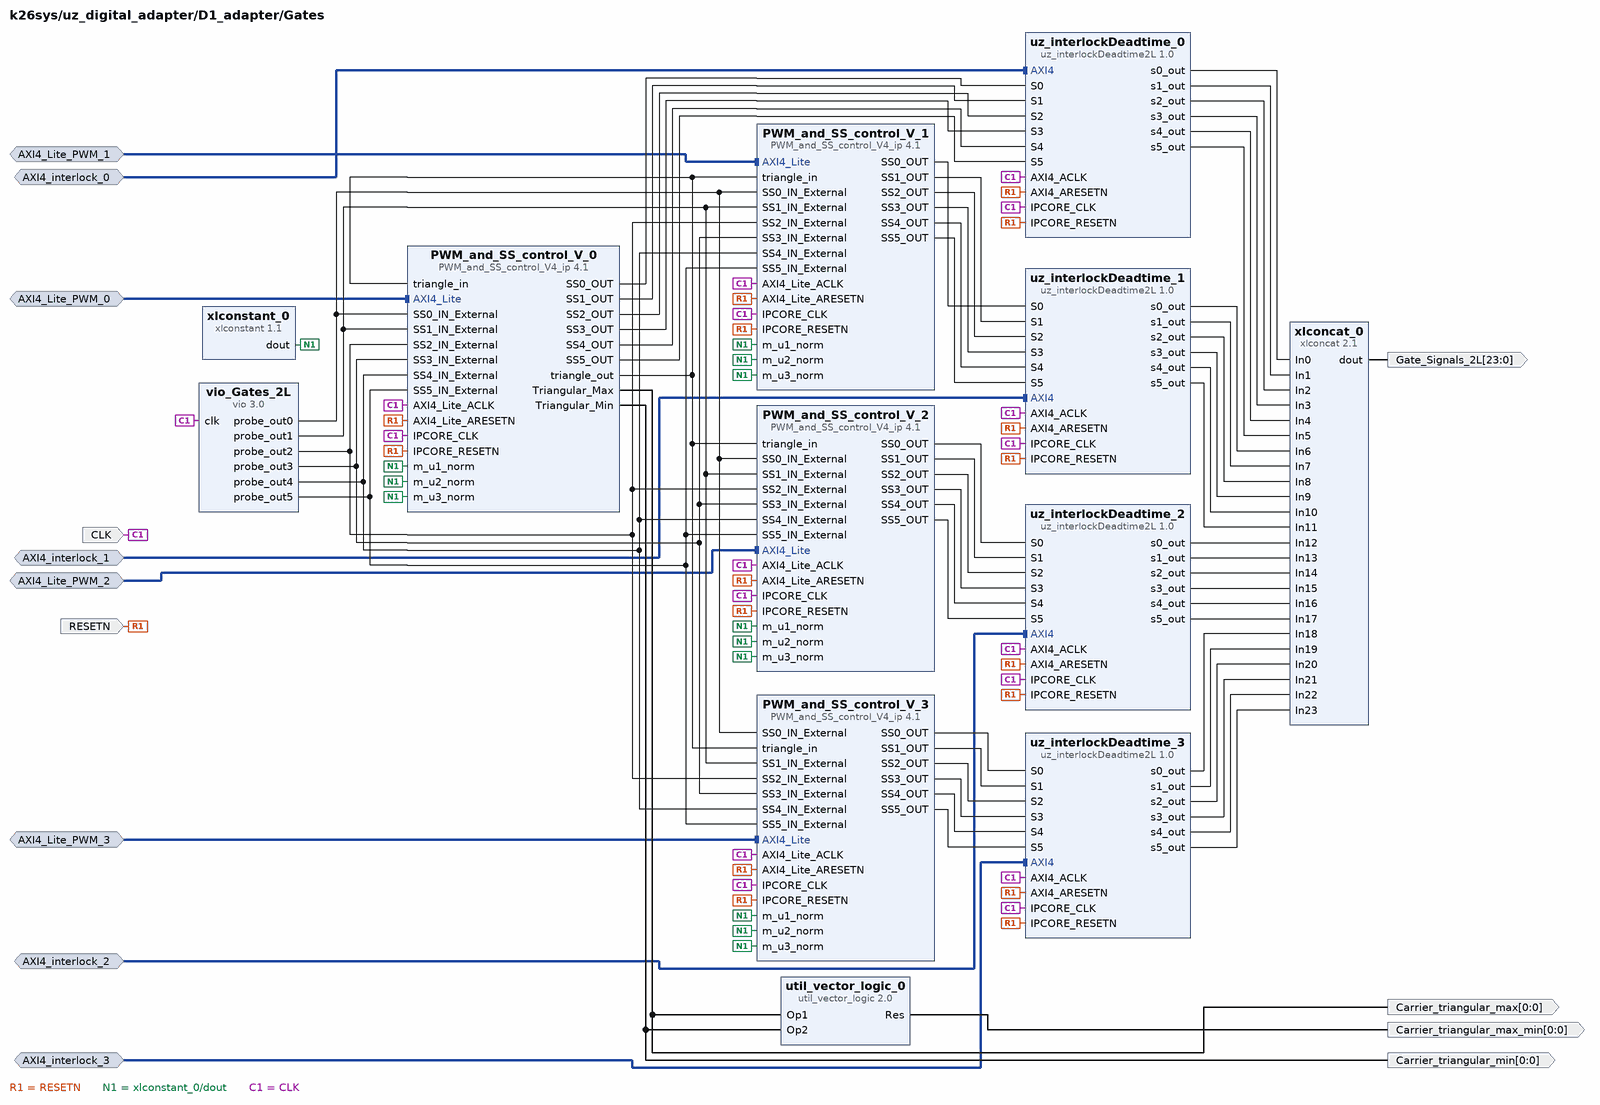
[diagram p13: block diagram inside /uz_digital_adapter/D1_adapter/Gates]
create_bd_intf_pin -mode Slave -vlnv xilinx.com:interface:aximm_rtl:1.0 AXI4_Lite_PWM_0
create_bd_intf_pin -mode Slave -vlnv xilinx.com:interface:aximm_rtl:1.0 AXI4_Lite_PWM_1
create_bd_intf_pin -mode Slave -vlnv xilinx.com:interface:aximm_rtl:1.0 AXI4_Lite_PWM_2
create_bd_intf_pin -mode Slave -vlnv xilinx.com:interface:aximm_rtl:1.0 AXI4_Lite_PWM_3
create_bd_intf_pin -mode Slave -vlnv xilinx.com:interface:aximm_rtl:1.0 AXI4_interlock_0
create_bd_intf_pin -mode Slave -vlnv xilinx.com:interface:aximm_rtl:1.0 AXI4_interlock_1
create_bd_intf_pin -mode Slave -vlnv xilinx.com:interface:aximm_rtl:1.0 AXI4_interlock_2
create_bd_intf_pin -mode Slave -vlnv xilinx.com:interface:aximm_rtl:1.0 AXI4_interlock_3
create_bd_pin -dir I -type clk CLK
create_bd_pin -dir O -from 0 -to 0 Carrier_triangular_max
create_bd_pin -dir O -from 0 -to 0 Carrier_triangular_max_min
create_bd_pin -dir O -from 0 -to 0 Carrier_triangular_min
create_bd_pin -dir O -from 23 -to 0 Gate_Signals_2L
create_bd_pin -dir I -type rst RESETN

create_bd_cell -type ip -vlnv xilinx.com:ip:PWM_and_SS_control_V4_ip:4.1 PWM_and_SS_control_V_0
create_bd_cell -type ip -vlnv xilinx.com:ip:PWM_and_SS_control_V4_ip:4.1 PWM_and_SS_control_V_1
create_bd_cell -type ip -vlnv xilinx.com:ip:PWM_and_SS_control_V4_ip:4.1 PWM_and_SS_control_V_2
create_bd_cell -type ip -vlnv xilinx.com:ip:PWM_and_SS_control_V4_ip:4.1 PWM_and_SS_control_V_3
create_bd_cell -type ip -vlnv xilinx.com:ip:util_vector_logic:2.0 util_vector_logic_0
set_property -dict {CONFIG.C_OPERATION or CONFIG.C_SIZE 1} [get_bd_cells util_vector_logic_0]
create_bd_cell -type ip -vlnv user.org:ip:uz_interlockDeadtime2L:1.0 uz_interlockDeadtime_0
create_bd_cell -type ip -vlnv user.org:ip:uz_interlockDeadtime2L:1.0 uz_interlockDeadtime_1
create_bd_cell -type ip -vlnv user.org:ip:uz_interlockDeadtime2L:1.0 uz_interlockDeadtime_2
create_bd_cell -type ip -vlnv user.org:ip:uz_interlockDeadtime2L:1.0 uz_interlockDeadtime_3
create_bd_cell -type ip -vlnv xilinx.com:ip:vio:3.0 vio_Gates_2L
set_property -dict {CONFIG.C_NUM_PROBE_IN 0 CONFIG.C_NUM_PROBE_OUT 6} [get_bd_cells vio_Gates_2L]
create_bd_cell -type ip -vlnv xilinx.com:ip:xlconcat:2.1 xlconcat_0
set_property -dict {CONFIG.NUM_PORTS 24} [get_bd_cells xlconcat_0]
create_bd_cell -type ip -vlnv xilinx.com:ip:xlconstant:1.1 xlconstant_0
set_property -dict {CONFIG.CONST_VAL 2048 CONFIG.CONST_WIDTH 14} [get_bd_cells xlconstant_0]

# ---- hierarchy /uz_digital_adapter/D2_adapter ----
current_bd_instance /uz_digital_adapter/D2_adapter
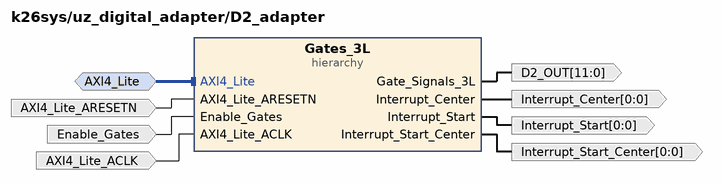
[diagram p14: block diagram inside /uz_digital_adapter/D2_adapter]
create_bd_intf_pin -mode Slave -vlnv xilinx.com:interface:aximm_rtl:1.0 AXI4_Lite
create_bd_pin -dir I -type clk AXI4_Lite_ACLK
create_bd_pin -dir I -type rst AXI4_Lite_ARESETN
create_bd_pin -dir O -from 11 -to 0 D2_OUT
create_bd_pin -dir I -type rst Enable_Gates
create_bd_pin -dir O -from 0 -to 0 Interrupt_Center
create_bd_pin -dir O -from 0 -to 0 Interrupt_Start
create_bd_pin -dir O -from 0 -to 0 Interrupt_Start_Center

create_bd_cell -type hier Gates_3L

# ---- hierarchy /uz_digital_adapter/D2_adapter/Gates_3L ----
current_bd_instance /uz_digital_adapter/D2_adapter/Gates_3L
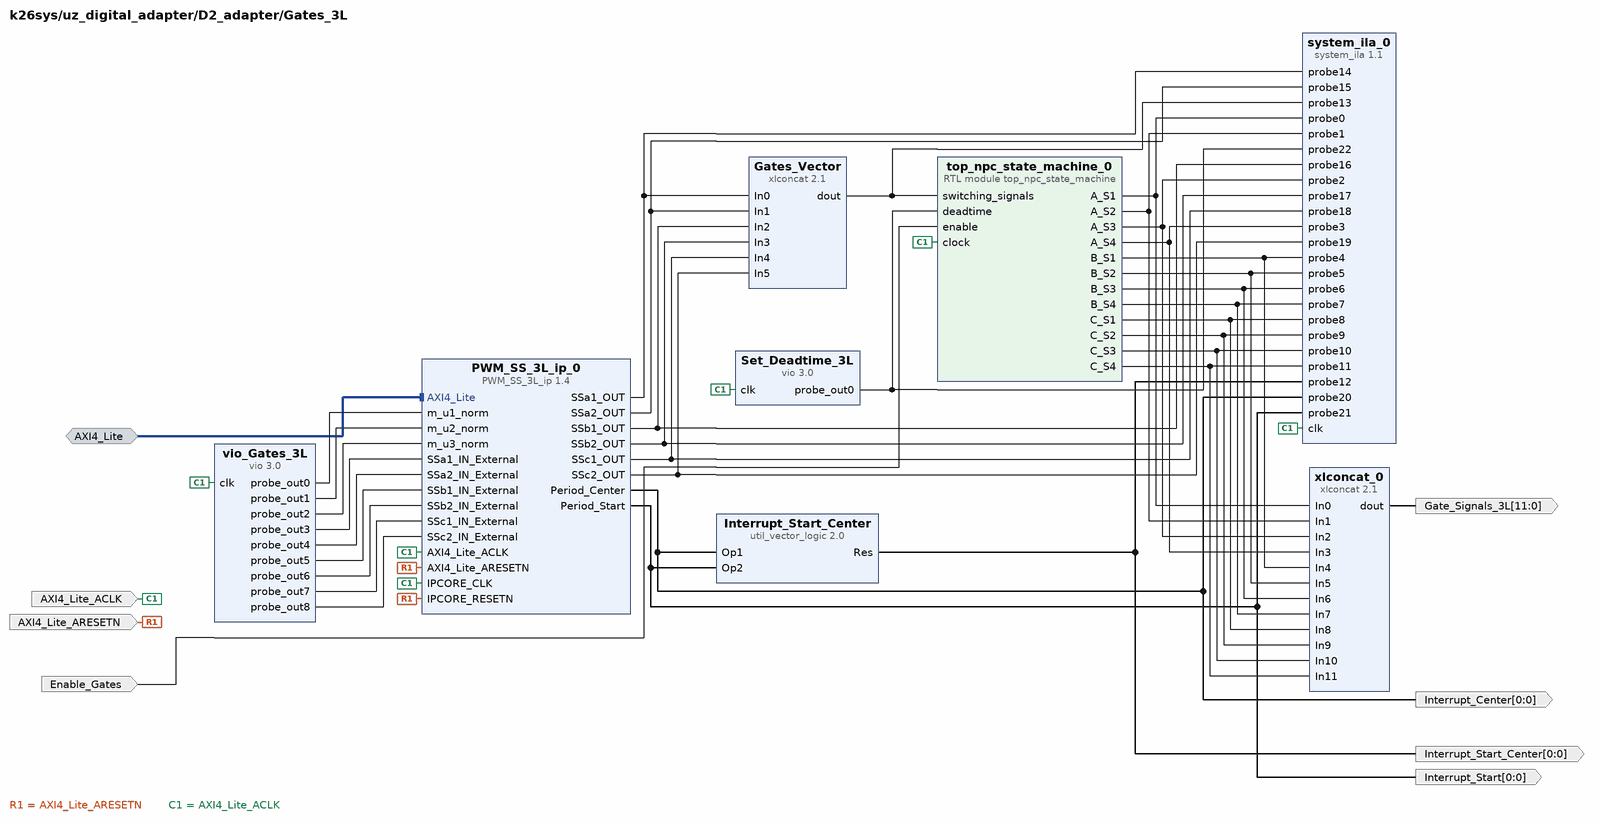
[diagram p15: block diagram inside /uz_digital_adapter/D2_adapter/Gates_3L]
create_bd_intf_pin -mode Slave -vlnv xilinx.com:interface:aximm_rtl:1.0 AXI4_Lite
create_bd_pin -dir I -type clk AXI4_Lite_ACLK
create_bd_pin -dir I -type rst AXI4_Lite_ARESETN
create_bd_pin -dir I -type rst Enable_Gates
create_bd_pin -dir O -from 11 -to 0 Gate_Signals_3L
create_bd_pin -dir O -from 0 -to 0 Interrupt_Center
create_bd_pin -dir O -from 0 -to 0 Interrupt_Start
create_bd_pin -dir O -from 0 -to 0 Interrupt_Start_Center

create_bd_cell -type ip -vlnv xilinx.com:ip:xlconcat:2.1 Gates_Vector
set_property -dict {CONFIG.NUM_PORTS 6} [get_bd_cells Gates_Vector]
create_bd_cell -type ip -vlnv xilinx.com:ip:util_vector_logic:2.0 Interrupt_Start_Center
set_property -dict {CONFIG.C_OPERATION or CONFIG.C_SIZE 1} [get_bd_cells Interrupt_Start_Center]
create_bd_cell -type ip -vlnv mwn.de:ip:PWM_SS_3L_ip:1.4 PWM_SS_3L_ip_0
create_bd_cell -type ip -vlnv xilinx.com:ip:vio:3.0 Set_Deadtime_3L
set_property -dict [list \
  CONFIG.C_NUM_PROBE_IN 0 \
  CONFIG.C_PROBE_OUT0_INIT_VAL 0x0C8 \
  CONFIG.C_PROBE_OUT0_WIDTH 10 \
] [get_bd_cells Set_Deadtime_3L]
create_bd_cell -type ip -vlnv xilinx.com:ip:system_ila:1.1 system_ila_0
set_property -dict {CONFIG.C_DATA_DEPTH 16384 CONFIG.C_MON_TYPE NATIVE CONFIG.C_NUM_OF_PROBES 23} [get_bd_cells system_ila_0]
create_bd_cell -type module -reference top_npc_state_machine top_npc_state_machine_0
create_bd_cell -type ip -vlnv xilinx.com:ip:vio:3.0 vio_Gates_3L
set_property -dict [list \
  CONFIG.C_NUM_PROBE_IN 0 \
  CONFIG.C_NUM_PROBE_OUT 9 \
  CONFIG.C_PROBE_OUT0_WIDTH 14 \
  CONFIG.C_PROBE_OUT1_WIDTH 14 \
  CONFIG.C_PROBE_OUT2_WIDTH 14 \
  CONFIG.C_PROBE_OUT6_WIDTH 1 \
  CONFIG.C_PROBE_OUT7_WIDTH 1 \
  CONFIG.C_PROBE_OUT8_WIDTH 1 \
] [get_bd_cells vio_Gates_3L]
create_bd_cell -type ip -vlnv xilinx.com:ip:xlconcat:2.1 xlconcat_0
set_property -dict {CONFIG.NUM_PORTS 12} [get_bd_cells xlconcat_0]

# ---- hierarchy /uz_digital_adapter/D3_adapter ----
current_bd_instance /uz_digital_adapter/D3_adapter
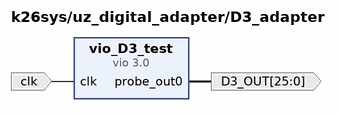
[diagram p16: block diagram inside /uz_digital_adapter/D3_adapter]
create_bd_pin -dir O -from 25 -to 0 D3_OUT
create_bd_pin -dir I -type clk clk

create_bd_cell -type ip -vlnv xilinx.com:ip:vio:3.0 vio_D3_test
set_property -dict {CONFIG.C_NUM_PROBE_IN 0 CONFIG.C_NUM_PROBE_OUT 1 CONFIG.C_PROBE_OUT0_WIDTH 26} [get_bd_cells vio_D3_test]

# ---- hierarchy /uz_digital_adapter/D5_adapter ----
current_bd_instance /uz_digital_adapter/D5_adapter
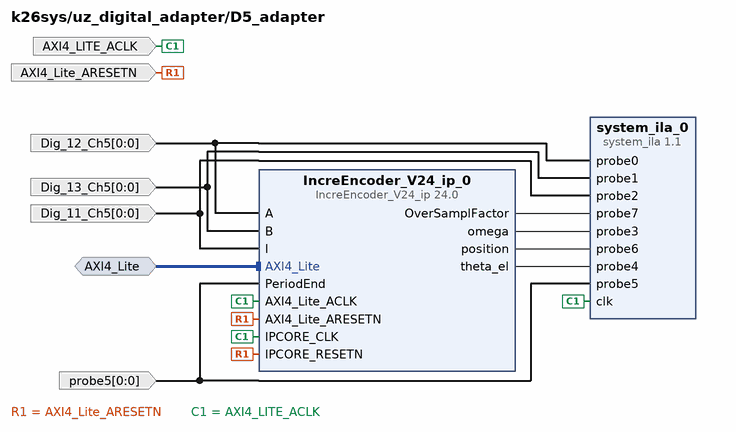
[diagram p17: block diagram inside /uz_digital_adapter/D5_adapter]
create_bd_intf_pin -mode Slave -vlnv xilinx.com:interface:aximm_rtl:1.0 AXI4_Lite
create_bd_pin -dir I -type clk AXI4_LITE_ACLK
create_bd_pin -dir I -type rst AXI4_Lite_ARESETN
create_bd_pin -dir I -from 0 -to 0 Dig_11_Ch5
create_bd_pin -dir I -from 0 -to 0 Dig_12_Ch5
create_bd_pin -dir I -from 0 -to 0 Dig_13_Ch5
create_bd_pin -dir I -from 0 -to 0 probe5

create_bd_cell -type ip -vlnv xilinx.com:ip:IncreEncoder_V24_ip:24.0 IncreEncoder_V24_ip_0
create_bd_cell -type ip -vlnv xilinx.com:ip:system_ila:1.1 system_ila_0
set_property -dict [list \
  CONFIG.C_DATA_DEPTH 1024 \
  CONFIG.C_MON_TYPE NATIVE \
  CONFIG.C_NUM_MONITOR_SLOTS 8 \
  CONFIG.C_NUM_OF_PROBES 8 \
] [get_bd_cells system_ila_0]

# ---- hierarchy /uz_user ----
current_bd_instance /uz_user
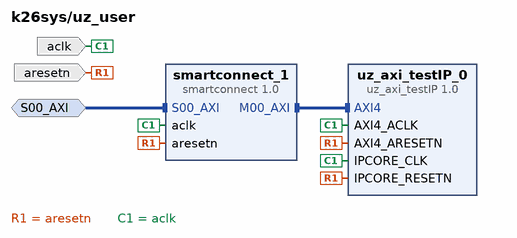
[diagram p18: block diagram inside /uz_user]
create_bd_intf_pin -mode Slave -vlnv xilinx.com:interface:aximm_rtl:1.0 S00_AXI
create_bd_pin -dir I -type clk aclk
create_bd_pin -dir I -type rst aresetn

create_bd_cell -type ip -vlnv xilinx.com:ip:smartconnect:1.0 smartconnect_1
set_property -dict {CONFIG.NUM_MI 1 CONFIG.NUM_SI 1} [get_bd_cells smartconnect_1]
create_bd_cell -type ip -vlnv user.org:ip:uz_axi_testIP:1.0 uz_axi_testIP_0

# ---- connections ----

current_bd_instance /uz_system
connect_bd_intf_net [get_bd_intf_pins Interrupt/AXI4_Lite] [get_bd_intf_pins smartconnect_0/M04_AXI]
connect_bd_intf_net [get_bd_intf_pins M00_AXI] [get_bd_intf_pins DataMover/M00_AXI]
connect_bd_intf_net [get_bd_intf_pins M10_AXI] [get_bd_intf_pins smartconnect_0/M10_AXI]
connect_bd_intf_net [get_bd_intf_pins S00_AXI] [get_bd_intf_pins smartconnect_0/S00_AXI]
connect_bd_intf_net [get_bd_intf_pins M00_AXI1] [get_bd_intf_pins smartconnect_0/M00_AXI]
connect_bd_intf_net [get_bd_intf_pins M02_AXI] [get_bd_intf_pins smartconnect_0/M02_AXI]
connect_bd_intf_net [get_bd_intf_pins M01_AXI] [get_bd_intf_pins smartconnect_0/M01_AXI]
connect_bd_intf_net [get_bd_intf_pins AXI4_Lite_PWM_0] [get_bd_intf_pins smartconnect_0/M08_AXI]
connect_bd_intf_net [get_bd_intf_pins M09_AXI] [get_bd_intf_pins smartconnect_0/M09_AXI]
connect_bd_intf_net [get_bd_intf_pins AXI4_interlock_0] [get_bd_intf_pins smartconnect_0/M07_AXI]
connect_bd_intf_net [get_bd_intf_pins AXI4_Lite_PWM_1] [get_bd_intf_pins smartconnect_0/M03_AXI]
connect_bd_intf_net [get_bd_intf_pins smartconnect_0/M05_AXI] [get_bd_intf_pins timer_uptime_64bit/S_AXI]
connect_bd_intf_net [get_bd_intf_pins smartconnect_0/M06_AXI] [get_bd_intf_pins uz_enable/S_AXI]
connect_bd_intf_net [get_bd_intf_pins M12_AXI] [get_bd_intf_pins smartconnect_0/M11_AXI]
connect_bd_intf_net [get_bd_intf_pins axi_timebase_wdt_0/S_AXI] [get_bd_intf_pins smartconnect_0/M12_AXI]
connect_bd_intf_net [get_bd_intf_pins smartconnect_0/M13_AXI] [get_bd_intf_pins smartconnect_1/S00_AXI]
connect_bd_intf_net [get_bd_intf_pins AXI4_Lite_PWM_2] [get_bd_intf_pins smartconnect_1/M00_AXI]
connect_bd_intf_net [get_bd_intf_pins AXI4_Lite_PWM_3] [get_bd_intf_pins smartconnect_1/M01_AXI]
connect_bd_intf_net [get_bd_intf_pins AXI4_interlock_1] [get_bd_intf_pins smartconnect_1/M02_AXI]
connect_bd_intf_net [get_bd_intf_pins AXI4_interlock_2] [get_bd_intf_pins smartconnect_1/M03_AXI]
connect_bd_intf_net [get_bd_intf_pins AXI4_interlock_3] [get_bd_intf_pins smartconnect_1/M04_AXI]
connect_bd_net -net ADC_A1_1 [get_bd_pins ADC_A1] [get_bd_pins DataMover/ADC_A1]
connect_bd_net -net ADC_A2_1 [get_bd_pins ADC_A2] [get_bd_pins DataMover/ADC_A2]
connect_bd_net -net ADC_A3_1 [get_bd_pins ADC_A3] [get_bd_pins DataMover/ADC_A3]
connect_bd_net -net Gates_3L_Interrupt_Center [get_bd_pins Interrupt5] [get_bd_pins Interrupt/Interrupt5]
connect_bd_net -net Gates_3L_Interrupt_Start [get_bd_pins Interrupt4] [get_bd_pins Interrupt/Interrupt4]
connect_bd_net -net Gates_3L_Interrupt_Start_Center [get_bd_pins Interrupt3] [get_bd_pins Interrupt/Interrupt3]
connect_bd_net -net Gates_Carrier_triangular_max1 [get_bd_pins Interrupt2] [get_bd_pins Interrupt/Interrupt2]
connect_bd_net -net Gates_Carrier_triangular_max_min [get_bd_pins Interrupt0] [get_bd_pins Interrupt/Interrupt0]
connect_bd_net -net Gates_Carrier_triangular_min1 [get_bd_pins Interrupt1] [get_bd_pins Interrupt/Interrupt1]
connect_bd_net -net In6_1 [get_bd_pins DataMover/write_done] [get_bd_pins Interrupt/Interrupt6]
connect_bd_net -net Interrupt_muxed [get_bd_pins Interrupt/trigger_converesions] [get_bd_pins trigger_converesions]
connect_bd_net -net Op2_1 [get_bd_pins uz_enable/Dout1] [get_bd_pins DataMover/Op2]
connect_bd_net [get_bd_pins Trigger_AXI2TCM] [get_bd_pins DataMover/Trigger_AXI2TCM]
connect_bd_net [get_bd_pins axi_timebase_wdt_0/wdt_interrupt] [get_bd_pins wdt_interrupt]
connect_bd_net -net proc_sys_reset_1_peripheral_aresetn [get_bd_pins uz_clocks/peripheral_aresetn] \
  [get_bd_pins peripheral_aresetn] [get_bd_pins DataMover/m00_axi_aresetn] [get_bd_pins Interrupt/IPCORE_RESETN] \
  [get_bd_pins axi_timebase_wdt_0/s_axi_aresetn] [get_bd_pins smartconnect_0/aresetn] [get_bd_pins smartconnect_1/aresetn] \
  [get_bd_pins timer_uptime_64bit/s_axi_aresetn] [get_bd_pins uz_enable/s_axi_aresetn]
connect_bd_net [get_bd_pins resetn] [get_bd_pins uz_clocks/resetn]
connect_bd_net [get_bd_pins uz_clocks/clk_50MHz] [get_bd_pins clk_50MHz] [get_bd_pins smartconnect_0/aclk2]
connect_bd_net [get_bd_pins uz_clocks/peripheral_aresetn1] [get_bd_pins peripheral_aresetn1]
connect_bd_net [get_bd_pins uz_clocks/peripheral_aresetn2] [get_bd_pins peripheral_aresetn2]
connect_bd_net [get_bd_pins uz_clocks/slowest_sync_clk] [get_bd_pins slowest_sync_clk] [get_bd_pins smartconnect_0/aclk1]
connect_bd_net [get_bd_pins uz_enable/D1_OUT_26] [get_bd_pins D1_OUT_26]
connect_bd_net [get_bd_pins uz_enable/D1_OUT_28] [get_bd_pins D1_OUT_28]
connect_bd_net [get_bd_pins uz_enable/D4_OUT_29] [get_bd_pins D1_OUT_29]
connect_bd_net [get_bd_pins uz_enable/Dout] [get_bd_pins Dout]
connect_bd_net -net xlconcat_0_dout [get_bd_pins Interrupt/Interrupt_vector] [get_bd_pins D4_OUT]
connect_bd_net -net zynq_ultra_ps_e_0_pl_clk1 [get_bd_pins clk] \
  [get_bd_pins DataMover/m00_axi_aclk] [get_bd_pins Interrupt/clk] [get_bd_pins axi_timebase_wdt_0/s_axi_aclk] \
  [get_bd_pins smartconnect_0/aclk] [get_bd_pins smartconnect_1/aclk] [get_bd_pins timer_uptime_64bit/s_axi_aclk] \
  [get_bd_pins uz_clocks/clk_in1] [get_bd_pins uz_enable/s_axi_aclk]

current_bd_instance /uz_system/DataMover
connect_bd_intf_net [get_bd_intf_pins M00_AXI] [get_bd_intf_pins AXI2TCM_0/M00_AXI]
connect_bd_net -net ADC_A1_1 [get_bd_pins ADC_A1] [get_bd_pins xlconcat_0/In0]
connect_bd_net -net ADC_A2_1 [get_bd_pins ADC_A2] [get_bd_pins xlconcat_0/In1]
connect_bd_net -net ADC_A3_1 [get_bd_pins ADC_A3] [get_bd_pins xlconcat_0/In2]
connect_bd_net -net ADCs_ADC_values_raw [get_bd_pins xlconcat_0/dout] [get_bd_pins AXI2TCM_0/DATA_IN] [get_bd_pins system_ila_0/probe0]
connect_bd_net [get_bd_pins AXI2TCM_0/axi_error] [get_bd_pins system_ila_0/probe3]
connect_bd_net [get_bd_pins AXI2TCM_0/write_done] [get_bd_pins write_done] [get_bd_pins system_ila_0/probe2]
connect_bd_net -net DATA_IN1_1 [get_bd_pins Trigger_AXI2TCM] [get_bd_pins system_ila_0/probe4] [get_bd_pins util_vector_logic_0/Op1]
connect_bd_net -net Op2_1 [get_bd_pins Op2] [get_bd_pins util_vector_logic_0/Op2]
connect_bd_net -net init_axi2tcm [get_bd_pins util_vector_logic_0/Res] [get_bd_pins AXI2TCM_0/init_axi_txn] [get_bd_pins system_ila_0/probe1]
connect_bd_net -net proc_sys_reset_1_peripheral_aresetn [get_bd_pins m00_axi_aresetn] [get_bd_pins AXI2TCM_0/m00_axi_aresetn]
connect_bd_net -net zynq_ultra_ps_e_0_pl_clk1 [get_bd_pins m00_axi_aclk] [get_bd_pins AXI2TCM_0/m00_axi_aclk] [get_bd_pins system_ila_0/clk]

current_bd_instance /uz_system/Interrupt
connect_bd_intf_net [get_bd_intf_pins AXI4_Lite] [get_bd_intf_pins mux_axi_ip_1/AXI4_Lite]
connect_bd_net [get_bd_pins Concat_interrupts/dout] [get_bd_pins mux_axi_ip_1/interrupts_in]
connect_bd_net -net Gates_3L_Interrupt_Center [get_bd_pins Interrupt5] [get_bd_pins Concat_interrupts/In5] [get_bd_pins system_ila_0/probe5]
connect_bd_net -net Gates_3L_Interrupt_Start [get_bd_pins Interrupt4] [get_bd_pins Concat_interrupts/In4] [get_bd_pins system_ila_0/probe4]
connect_bd_net -net Gates_3L_Interrupt_Start_Center [get_bd_pins Interrupt3] [get_bd_pins Concat_interrupts/In3] [get_bd_pins system_ila_0/probe3]
connect_bd_net -net Gates_Carrier_triangular_max1 [get_bd_pins Interrupt2] [get_bd_pins Concat_interrupts/In2] [get_bd_pins system_ila_0/probe2]
connect_bd_net -net Gates_Carrier_triangular_max_min [get_bd_pins Interrupt0] [get_bd_pins Concat_interrupts/In0] [get_bd_pins system_ila_0/probe0]
connect_bd_net -net Gates_Carrier_triangular_min1 [get_bd_pins Interrupt1] [get_bd_pins Concat_interrupts/In1] [get_bd_pins system_ila_0/probe1]
connect_bd_net -net In6_1 [get_bd_pins Interrupt6] [get_bd_pins Concat_interrupts/In6]
connect_bd_net [get_bd_pins adc_delay/probe_out0] [get_bd_pins delay_trigger_0/delay_cycles]
connect_bd_net [get_bd_pins delay_trigger_0/a_out] [get_bd_pins trigger_converesions] [get_bd_pins system_ila_0/probe8]
connect_bd_net [get_bd_pins mux_axi_ip_1/interrupt_out_adc] [get_bd_pins delay_trigger_0/a_in] [get_bd_pins system_ila_0/probe6]
connect_bd_net [get_bd_pins mux_axi_ip_1/interrupt_out_isr] [get_bd_pins Interrupt_vector]
connect_bd_net [get_bd_pins mux_axi_ip_1/select_out] [get_bd_pins system_ila_0/probe7]
connect_bd_net -net proc_sys_reset_1_peripheral_aresetn [get_bd_pins IPCORE_RESETN] \
  [get_bd_pins mux_axi_ip_1/AXI4_Lite_ARESETN] [get_bd_pins mux_axi_ip_1/IPCORE_RESETN]
connect_bd_net -net vio_0_probe_out0 [get_bd_pins vio_interrupt/probe_out0] [get_bd_pins Concat_interrupts/In7]
connect_bd_net -net zynq_ultra_ps_e_0_pl_clk1 [get_bd_pins clk] \
  [get_bd_pins adc_delay/clk] [get_bd_pins delay_trigger_0/clk] [get_bd_pins mux_axi_ip_1/AXI4_Lite_ACLK] \
  [get_bd_pins mux_axi_ip_1/IPCORE_CLK] [get_bd_pins system_ila_0/clk] [get_bd_pins vio_interrupt/clk]

current_bd_instance /uz_system/uz_clocks
connect_bd_net [get_bd_pins clk_wiz_0/clk_25MHz] [get_bd_pins proc_sys_reset_25MHz/slowest_sync_clk]
connect_bd_net [get_bd_pins proc_sys_reset_10MHz/peripheral_aresetn] [get_bd_pins peripheral_aresetn2]
connect_bd_net -net proc_sys_reset_1_peripheral_aresetn [get_bd_pins proc_sys_reset_100MHz/peripheral_aresetn] [get_bd_pins peripheral_aresetn]
connect_bd_net [get_bd_pins proc_sys_reset_50MHz/peripheral_aresetn] [get_bd_pins peripheral_aresetn1]
connect_bd_net -net zynq_ultra_ps_e_0_pl_clk1 [get_bd_pins clk_in1] \
  [get_bd_pins clk_wiz_0/clk_in1] [get_bd_pins proc_sys_reset_100MHz/slowest_sync_clk]
connect_bd_net -net zynq_ultra_ps_e_0_pl_clk2 [get_bd_pins clk_wiz_0/clk_10MHz] \
  [get_bd_pins slowest_sync_clk] [get_bd_pins proc_sys_reset_10MHz/slowest_sync_clk]
connect_bd_net -net zynq_ultra_ps_e_0_pl_clk3 [get_bd_pins clk_wiz_0/clk_50MHz] \
  [get_bd_pins clk_50MHz] [get_bd_pins proc_sys_reset_50MHz/slowest_sync_clk]
connect_bd_net -net zynq_ultra_ps_e_0_pl_resetn0 [get_bd_pins resetn] \
  [get_bd_pins clk_wiz_0/resetn] [get_bd_pins proc_sys_reset_100MHz/ext_reset_in] \
  [get_bd_pins proc_sys_reset_10MHz/ext_reset_in] [get_bd_pins proc_sys_reset_25MHz/ext_reset_in] \
  [get_bd_pins proc_sys_reset_50MHz/ext_reset_in]
